# Altium project project.PrjPcb
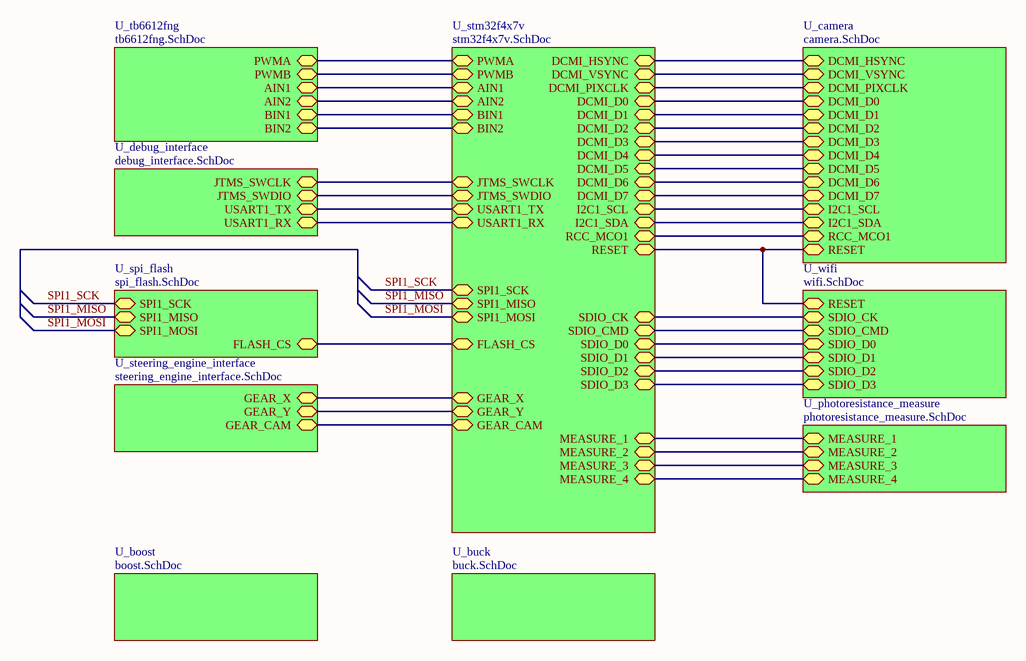
[diagram p0: main_control_board.SchDoc]
7 sheets, 42 parts. Net scope: hierarchical (ports join the sheet entries above them; power ports are global).
Board file: main_control_board_1.1.0.PcbDoc
Sheets:
  main_control_board.SchDoc
    U_spi_flash = spi_flash.SchDoc
    U_debug_interface = debug_interface.SchDoc
    U_camera = camera.SchDoc
    U_tb6612fng = tb6612fng.SchDoc
    U_boost = boost.SchDoc
    U_photoresistance_measure = photoresistance_measure.SchDoc

## Sheet main_control_board.SchDoc
size A4

### Sub-sheets
U_boost = boost.SchDoc: no entries
U_buck = buck.SchDoc (file not in this document): no entries
U_camera = camera.SchDoc: DCMI_VSYNC (bidir), DCMI_HSYNC (bidir), RESET (bidir), DCMI_D1 (bidir), DCMI_D3 (bidir), DCMI_D5 (bidir), DCMI_D7 (bidir), RCC_MCO1 (bidir), I2C1_SCL (bidir), I2C1_SDA (bidir), DCMI_D6 (bidir), DCMI_D4 (bidir), DCMI_D2 (bidir), DCMI_D0 (bidir), DCMI_PIXCLK (bidir)
U_debug_interface = debug_interface.SchDoc: USART1_RX (bidir), USART1_TX (bidir), JTMS_SWCLK (bidir), JTMS_SWDIO (bidir)
U_photoresistance_measure = photoresistance_measure.SchDoc: MEASURE_1 (bidir), MEASURE_2 (bidir), MEASURE_3 (bidir), MEASURE_4 (bidir)
U_spi_flash = spi_flash.SchDoc: SPI1_SCK (bidir), SPI1_MOSI (bidir), SPI1_MISO (bidir), FLASH_CS (bidir)
U_steering_engine_interface = steering_engine_interface.SchDoc (file not in this document): GEAR_X (bidir), GEAR_Y (bidir), GEAR_CAM (bidir)
U_stm32f4x7v = stm32f4x7v.SchDoc (file not in this document): DCMI_HSYNC (bidir), DCMI_VSYNC (bidir), RESET (bidir), DCMI_D1 (bidir), DCMI_D3 (bidir), DCMI_D5 (bidir), DCMI_D7 (bidir), RCC_MCO1 (bidir), I2C1_SCL (bidir), I2C1_SDA (bidir), DCMI_D6 (bidir), DCMI_D4 (bidir), DCMI_D2 (bidir), DCMI_D0 (bidir), DCMI_PIXCLK (bidir), USART1_RX (bidir), USART1_TX (bidir), JTMS_SWCLK (bidir), JTMS_SWDIO (bidir), SDIO_D2 (bidir), SDIO_D1 (bidir), SDIO_CK (bidir), SDIO_CMD (bidir), SDIO_D3 (bidir), SDIO_D0 (bidir), PWMA (bidir), AIN2 (bidir), AIN1 (bidir), BIN1 (bidir), BIN2 (bidir), PWMB (bidir), SPI1_SCK (bidir), SPI1_MOSI (bidir), SPI1_MISO (bidir), FLASH_CS (bidir), GEAR_X (bidir), GEAR_Y (bidir), GEAR_CAM (bidir), MEASURE_4 (bidir), MEASURE_2 (bidir), MEASURE_3 (bidir), MEASURE_1 (bidir)
U_tb6612fng = tb6612fng.SchDoc: PWMA (bidir), AIN2 (bidir), AIN1 (bidir), BIN1 (bidir), BIN2 (bidir), PWMB (bidir)
U_wifi = wifi.SchDoc (file not in this document): SDIO_D2 (bidir), SDIO_D1 (bidir), SDIO_CK (bidir), SDIO_CMD (bidir), SDIO_D3 (bidir), SDIO_D0 (bidir), RESET (bidir)

### Nets
SPI1_MISO: sheet U_stm32f4x7v/SPI1_MISO, sheet U_spi_flash/SPI1_MISO
SPI1_MOSI: sheet U_stm32f4x7v/SPI1_MOSI, sheet U_spi_flash/SPI1_MOSI
SPI1_SCK: sheet U_stm32f4x7v/SPI1_SCK, sheet U_spi_flash/SPI1_SCK
NetIC1_1: sheet U_stm32f4x7v/FLASH_CS, sheet U_spi_flash/FLASH_CS
NetJP1_3: sheet U_stm32f4x7v/DCMI_VSYNC, sheet U_camera/DCMI_VSYNC
NetJP1_4: sheet U_stm32f4x7v/I2C1_SCL, sheet U_camera/I2C1_SCL
NetJP1_5: sheet U_stm32f4x7v/DCMI_HSYNC, sheet U_camera/DCMI_HSYNC
NetJP1_6: sheet U_stm32f4x7v/I2C1_SDA, sheet U_camera/I2C1_SDA
NetJP1_7: sheet U_stm32f4x7v/RESET, sheet U_wifi/RESET, sheet U_camera/RESET
NetJP1_8: sheet U_stm32f4x7v/DCMI_D0, sheet U_camera/DCMI_D0
NetJP1_9: sheet U_stm32f4x7v/DCMI_D1, sheet U_camera/DCMI_D1
NetJP1_10: sheet U_stm32f4x7v/DCMI_D2, sheet U_camera/DCMI_D2
NetJP1_11: sheet U_stm32f4x7v/DCMI_D3, sheet U_camera/DCMI_D3
NetJP1_12: sheet U_stm32f4x7v/DCMI_D4, sheet U_camera/DCMI_D4
NetJP1_13: sheet U_stm32f4x7v/DCMI_D5, sheet U_camera/DCMI_D5
NetJP1_14: sheet U_stm32f4x7v/DCMI_D6, sheet U_camera/DCMI_D6
NetJP1_15: sheet U_stm32f4x7v/DCMI_D7, sheet U_camera/DCMI_D7
NetJP1_16: sheet U_stm32f4x7v/DCMI_PIXCLK, sheet U_camera/DCMI_PIXCLK
NetJP1_17: sheet U_stm32f4x7v/RCC_MCO1, sheet U_camera/RCC_MCO1
NetJP2_2: sheet U_stm32f4x7v/USART1_RX, sheet U_debug_interface/USART1_RX
NetJP2_3: sheet U_stm32f4x7v/USART1_TX, sheet U_debug_interface/USART1_TX
NetJP3_2: sheet U_stm32f4x7v/JTMS_SWDIO, sheet U_debug_interface/JTMS_SWDIO
NetJP3_3: sheet U_stm32f4x7v/JTMS_SWCLK, sheet U_debug_interface/JTMS_SWCLK
NetJP11_2: sheet U_stm32f4x7v/MEASURE_1, sheet U_photoresistance_measure/MEASURE_1
NetJP12_2: sheet U_stm32f4x7v/MEASURE_2, sheet U_photoresistance_measure/MEASURE_2
NetJP13_2: sheet U_stm32f4x7v/MEASURE_3, sheet U_photoresistance_measure/MEASURE_3
NetJP14_2: sheet U_stm32f4x7v/MEASURE_4, sheet U_photoresistance_measure/MEASURE_4
NetU2_15: sheet U_stm32f4x7v/PWMB, sheet U_tb6612fng/PWMB
NetU2_16: sheet U_stm32f4x7v/BIN2, sheet U_tb6612fng/BIN2
NetU2_17: sheet U_stm32f4x7v/BIN1, sheet U_tb6612fng/BIN1
NetU2_21: sheet U_stm32f4x7v/AIN1, sheet U_tb6612fng/AIN1
NetU2_22: sheet U_stm32f4x7v/AIN2, sheet U_tb6612fng/AIN2
NetU2_23: sheet U_stm32f4x7v/PWMA, sheet U_tb6612fng/PWMA
(unnamed): sheet U_stm32f4x7v/SDIO_D2, sheet U_wifi/SDIO_D2
(unnamed): sheet U_stm32f4x7v/SDIO_D1, sheet U_wifi/SDIO_D1
(unnamed): sheet U_stm32f4x7v/SDIO_CK, sheet U_wifi/SDIO_CK
(unnamed): sheet U_stm32f4x7v/SDIO_CMD, sheet U_wifi/SDIO_CMD
(unnamed): sheet U_stm32f4x7v/SDIO_D3, sheet U_wifi/SDIO_D3
(unnamed): sheet U_stm32f4x7v/SDIO_D0, sheet U_wifi/SDIO_D0
(unnamed): sheet U_stm32f4x7v/GEAR_X, sheet U_steering_engine_interface/GEAR_X
(unnamed): sheet U_stm32f4x7v/GEAR_Y, sheet U_steering_engine_interface/GEAR_Y
(unnamed): sheet U_stm32f4x7v/GEAR_CAM, sheet U_steering_engine_interface/GEAR_CAM

## Sheet spi_flash.SchDoc
size A4
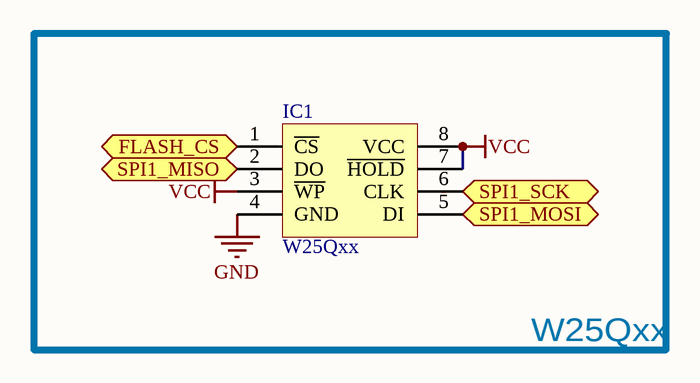
[diagram p1: spi_flash.SchDoc]

### Parts
IC1  W25Qxx  [SOP8W_N]

### Blocks framed on the sheet
W25Qxx: IC1

### Ports
FLASH_CS (bidir), SPI1_MISO (bidir), SPI1_MOSI (bidir), SPI1_SCK (bidir)

### Nets
GND: IC1.4(GND)
VCC: IC1.3(~{WP}) IC1.7(~{HOLD}) IC1.8(VCC)
SPI1_MISO: IC1.2(DO) ; port SPI1_MISO
SPI1_MOSI: IC1.5(DI) ; port SPI1_MOSI
SPI1_SCK: IC1.6(CLK) ; port SPI1_SCK
NetIC1_1: IC1.1(~{CS}) ; port FLASH_CS

### Library data of the parts
IC1 = W25Qxx: 外置Flash; 版权归属: 源创客; BOM名称: 外置Flash; 学习资源: www.ooocke.com

## Sheet debug_interface.SchDoc
size A4
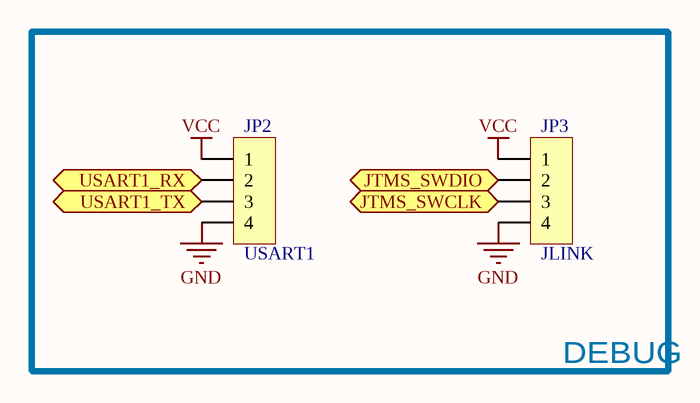
[diagram p2: debug_interface.SchDoc]

### Parts
JP2  USART1  [MX 1.25-LS-4P]
JP3  JLINK  [MX 1.25-LS-4P]

### Blocks framed on the sheet
DEBUG: JP2 JP3

### Ports
JTMS_SWCLK (bidir), JTMS_SWDIO (bidir), USART1_RX (bidir), USART1_TX (bidir)

### Nets
GND: JP2.4 JP3.4
VCC: JP2.1 JP3.1
NetJP2_2: JP2.2 ; port USART1_RX
NetJP2_3: JP2.3 ; port USART1_TX
NetJP3_2: JP3.2 ; port JTMS_SWDIO
NetJP3_3: JP3.3 ; port JTMS_SWCLK

### Library data of the parts
JP2 JP3 = Header 4: 4P接插件; 版权归属: 源创客; BOM名称: 4P接插件; 学习资源: www.ooocke.com

## Sheet camera.SchDoc
size A4
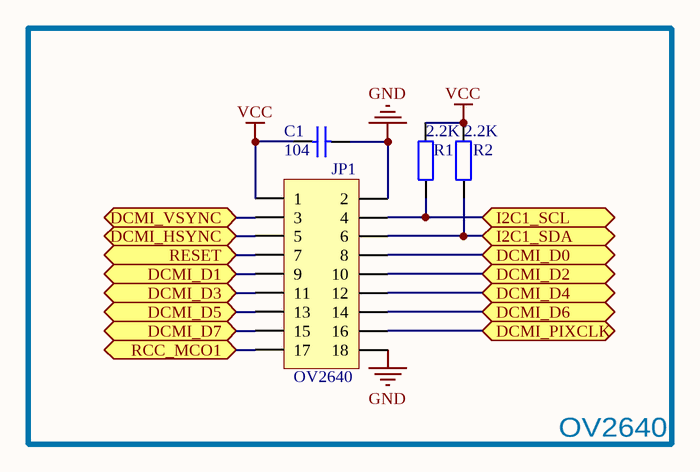
[diagram p3: camera.SchDoc]

### Parts
C1  104  [C 0603_L]
JP1  OV2640  [HDR2.54-LI-2x9P]
R1  2.2K  [R 0603_L]
R2  2.2K  [R 0603_L]

### Blocks framed on the sheet
OV2640: C1 JP1 R1 R2

### Ports
DCMI_D0 (bidir), DCMI_D1 (bidir), DCMI_D2 (bidir), DCMI_D3 (bidir), DCMI_D4 (bidir), DCMI_D5 (bidir), DCMI_D6 (bidir), DCMI_D7 (bidir), DCMI_HSYNC (bidir), DCMI_PIXCLK (bidir), DCMI_VSYNC (bidir), I2C1_SCL (bidir), I2C1_SDA (bidir), RCC_MCO1 (bidir), RESET (bidir)

### Nets
GND: C1.1 JP1.2 JP1.18
VCC: C1.2 JP1.1 R1.2 R2.2
NetJP1_3: JP1.3 ; port DCMI_VSYNC
NetJP1_4: JP1.4 R1.1 ; port I2C1_SCL
NetJP1_5: JP1.5 ; port DCMI_HSYNC
NetJP1_6: JP1.6 R2.1 ; port I2C1_SDA
NetJP1_7: JP1.7 ; port RESET
NetJP1_8: JP1.8 ; port DCMI_D0
NetJP1_9: JP1.9 ; port DCMI_D1
NetJP1_10: JP1.10 ; port DCMI_D2
NetJP1_11: JP1.11 ; port DCMI_D3
NetJP1_12: JP1.12 ; port DCMI_D4
NetJP1_13: JP1.13 ; port DCMI_D5
NetJP1_14: JP1.14 ; port DCMI_D6
NetJP1_15: JP1.15 ; port DCMI_D7
NetJP1_16: JP1.16 ; port DCMI_PIXCLK
NetJP1_17: JP1.17 ; port RCC_MCO1

### Library data of the parts
C1 = Cap: Capacitor; Published: 8-Jun-2000; LatestRevisionDate: 17-Jul-2002; LatestRevisionNote: Re-released for DXP Platform.; PackageReference: RAD-0.3; Publisher: Altium Limited; PackageDescription: Radial Cap, Thru-Hole; 2 Leads; 0.3 in Pin Spacing; Value: 104
JP1 = Header 9X2: 9*2P接插件; 版权归属: 源创客; BOM名称: 9*2P接插件; 学习资源: www.ooocke.com
R1 R2 = Res2: Resistor; Published: 8-Jun-2000; LatestRevisionDate: 17-Jul-2002; LatestRevisionNote: Re-released for DXP Platform.; PackageReference: AXIAL-0.4; Publisher: Altium Limited; PackageDescription: Axial Device, Thru-Hole; 2 Leads; 0.4 in Pin Spacing; Value: 2.2K

## Sheet tb6612fng.SchDoc
size A4
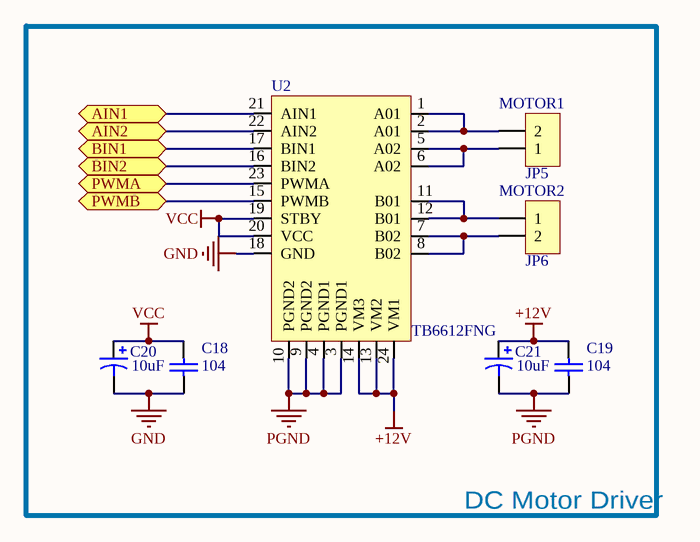
[diagram p4: tb6612fng.SchDoc]

### Parts
C18  104  [C 0603_L]
C19  104  [C 0603_L]
C20  10uF  [CD A(3216)]
C21  10uF  [CD A(3216)]
JP5  MOTOR1  [XH2.54-LI-2P]
JP6  MOTOR2  [XH2.54-LI-2P]
U2  TB6612FNG  [SSOP24_N]

### Blocks framed on the sheet
DC Motor Driver: C18-C21 JP5 JP6 U2

### Ports
AIN1 (bidir), AIN2 (bidir), BIN1 (bidir), BIN2 (bidir), PWMA (bidir), PWMB (bidir)

### Nets
+12V: C19.2 C21.1 U2.13(VM2) U2.14(VM3) U2.24(VM1)
GND: C18.1 C20.2 U2.18(GND)
PGND: C19.1 C21.2 U2.3(PGND1) U2.4(PGND1) U2.9(PGND2) U2.10(PGND2)
VCC: C18.2 C20.1 U2.19(STBY) U2.20(VCC)
NetJP5_1: JP5.1 U2.5(A02) U2.6(A02)
NetJP5_2: JP5.2 U2.1(A01) U2.2(A01)
NetJP6_1: JP6.1 U2.11(B01) U2.12(B01)
NetJP6_2: JP6.2 U2.7(B02) U2.8(B02)
NetU2_15: U2.15(PWMB) ; port PWMB
NetU2_16: U2.16(BIN2) ; port BIN2
NetU2_17: U2.17(BIN1) ; port BIN1
NetU2_21: U2.21(AIN1) ; port AIN1
NetU2_22: U2.22(AIN2) ; port AIN2
NetU2_23: U2.23(PWMA) ; port PWMA

### Library data of the parts
C18 C19 = Cap: Capacitor; Published: 8-Jun-2000; LatestRevisionDate: 17-Jul-2002; LatestRevisionNote: Re-released for DXP Platform.; PackageReference: RAD-0.3; Publisher: Altium Limited; PackageDescription: Radial Cap, Thru-Hole; 2 Leads; 0.3 in Pin Spacing; Value: 104
C20 C21 = Cap Pol1: Polarized Capacitor (Radial); Published: 8-Jun-2000; LatestRevisionDate: 17-Jul-2002; LatestRevisionNote: Re-released for DXP Platform.; PackageReference: RB7.6-15; Publisher: Altium Limited; PackageDescription: Polarized Capacitor (Radial); 2 Leads; Value: 10uF
JP5 JP6 = Header 2: 2P接插件; 版权归属: 源创客; BOM名称: 2P接插件; 学习资源: www.ooocke.com
U2 = TB6612FNG: DC_MOTOR_DRIVER

## Sheet boost.SchDoc
size A4
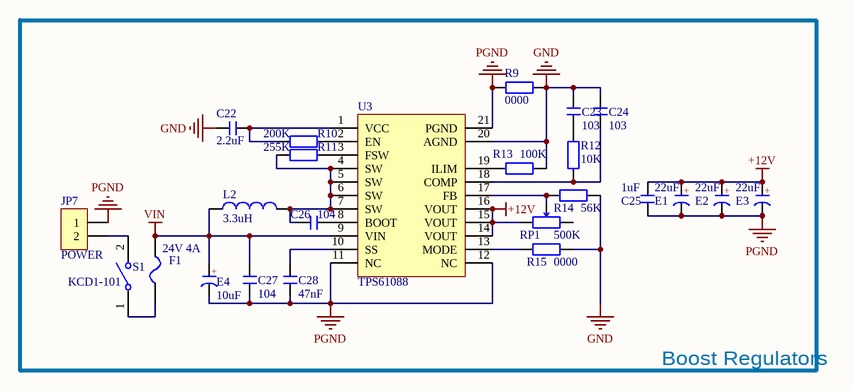
[diagram p5: boost.SchDoc]

### Parts
C22  2.2uF  [C 0603_L]
C23  103  [C 0603_L]
C24  103  [C 0603_L]
C25  1uF  [C 0603_L]
C26  104  [C 0603_L]
C27  104  [C 0603_L]
C28  47nF  [C 0603_L]
E1  22uF  [CD A(3216)]
E2  22uF  [CD A(3216)]
E3  22uF  [CD A(3216)]
E4  10uF  [CD A(3216)]
F1  24V 4A  [FU 1206]
JP7  POWER  [KF301-5.0-2P]
L2  3.3uH  [CDRH127]
R9  0000  [R 0603_L]
R10  200K  [R 0603_L]
R11  255K  [R 0603_L]
R12  10K  [R 0603_L]
R13  100K  [R 0603_L]
R14  56K  [R 0603_L]
R15  0000  [R 0603_L]
RP1  500K  [3296W]
S1  KCD1-101  [KCD1-101]
U3  TPS61088  [S-PVQFN-N20]

### Blocks framed on the sheet
Boost Regulators: C22-C28 E1-E4 F1 JP7 L2 R9-R15 RP1 S1 U3

### Nets
+12V: C25.2 E1.1(A) E2.1(A) E3.1(A) RP1.1 U3.14(VOUT) U3.15(VOUT) U3.16(VOUT)
GND: C22.2 C23.2 C24.2 R9.2 R13.2 R14.1 R15.2 U3.20(AGND)
PGND: C25.1 C27.1 C28.1 E1.2(K) E2.2(K) E3.2(K) E4.2(K) JP7.1 R9.1 U3.11(NC) U3.12(NC) U3.21(PGND)
VIN: C27.2 E4.1(A) F1.2 L2.1 U3.9(VIN)
NetC22_1: C22.1 R10.2 U3.1(VCC)
NetC23_1: C23.1 R12.2
NetC24_1: C24.1 R12.1 U3.18(COMP)
NetC26_1: C26.1 U3.8(BOOT)
NetC26_2: C26.2 L2.2 R11.2 U3.4(SW) U3.5(SW) U3.6(SW) U3.7(SW)
NetC28_2: C28.2 U3.10(SS)
NetF1_1: F1.1 S1.1
NetJP7_2: JP7.2 S1.2
NetR10_1: R10.1 U3.2(EN)
NetR11_1: R11.1 U3.3(FSW)
NetR13_1: R13.1 U3.19(ILIM)
NetR14_2: R14.2 RP1.2 U3.17(FB)
NetR15_1: R15.1 U3.13(MODE)

Not connected (* = marked no-connect by the designer): RP1 3

### Notes on the sheet
- (in symbol C-CD) +

### Library data of the parts
C22-C28 = C: 无极性贴片电容; 版权归属: 源创客; BOM名称: 无极性贴片电容; 学习资源: www.ooocke.com
E1-E4 = C-CD: 贴片钽电容; 版权归属: 源创客; BOM名称: 贴片钽电容; 学习资源: www.ooocke.com
F1 = FU: 贴片保险丝; 版权归属: 源创客; BOM名称: 贴片保险丝; 学习资源: www.ooocke.com
JP7 = Header 2: 2P接插件; 版权归属: 源创客; BOM名称: 2P接插件; 学习资源: www.ooocke.com
L2 = Inductor: Code_IEC: 1005; Published: 8-Jun-2000; LatestRevisionDate: 29-May-2009; LatestRevisionNote: IPC-7351 Footprint Added.; PackageReference: 0402-A; Publisher: Altium Limited; PackageDescription: Chip Inductor; Code_JEITA: 0402; Value: 3.3uH
R9-R15 = R: 贴片电阻; 版权归属: 源创客; BOM名称: 贴片电阻; 学习资源: www.ooocke.com
RP1 = RP-ID: 插件单联电位器; BOM名称: 插件电位器; 版权归属: 源创客; 学习资源: www.ooocke.com
S1 = KCD1-101: 1路单刀船型开关; 版权归属: 源创客; BOM名称: 1路单刀船型开关; 学习资源: www.ooocke.com

## Sheet photoresistance_measure.SchDoc
size A4
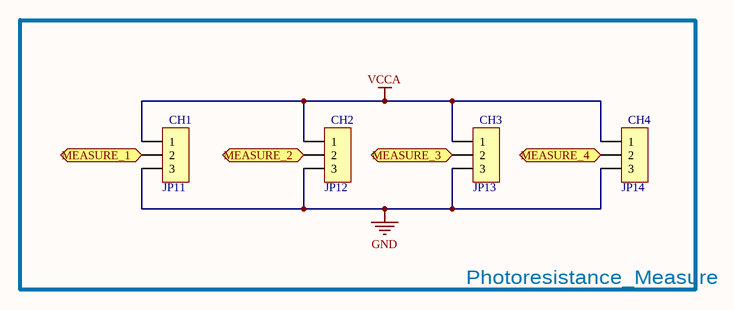
[diagram p6: photoresistance_measure.SchDoc]

### Parts
JP11  CH1  [HDR2.54-LI-3P]
JP12  CH2  [HDR2.54-LI-3P]
JP13  CH3  [HDR2.54-LI-3P]
JP14  CH4  [HDR2.54-LI-3P]

### Blocks framed on the sheet
Photoresistance_Measure: JP11-JP14

### Ports
MEASURE_1 (bidir), MEASURE_2 (bidir), MEASURE_3 (bidir), MEASURE_4 (bidir)

### Nets
GND: JP11.3 JP12.3 JP13.3 JP14.3
VCCA: JP11.1 JP12.1 JP13.1 JP14.1
NetJP11_2: JP11.2 ; port MEASURE_1
NetJP12_2: JP12.2 ; port MEASURE_2
NetJP13_2: JP13.2 ; port MEASURE_3
NetJP14_2: JP14.2 ; port MEASURE_4

### Library data of the parts
JP11-JP14 = Header 3: 3P接插件; 版权归属: 源创客; BOM名称: 3P接插件; 学习资源: www.ooocke.com

## Nets that join several sheets
+12V: tb6612fng (5 pins), boost (8 pins)
GND: spi_flash (IC1.4), debug_interface (JP2.4 JP3.4), camera (C1.1 JP1.2 JP1.18), tb6612fng (C18.1 C20.2 U2.18), boost (8 pins), photoresistance_measure (JP11.3 JP12.3 JP13.3 JP14.3)
PGND: tb6612fng (6 pins), boost (12 pins)
VCC: spi_flash (IC1.3 IC1.7 IC1.8), debug_interface (JP2.1 JP3.1), camera (C1.2 JP1.1 R1.2 R2.2), tb6612fng (C18.2 C20.1 U2.19 U2.20)